# EAGLE design TubeBoard-Logic (EAGLE 9.3.2)

## Sheet 1 of 2
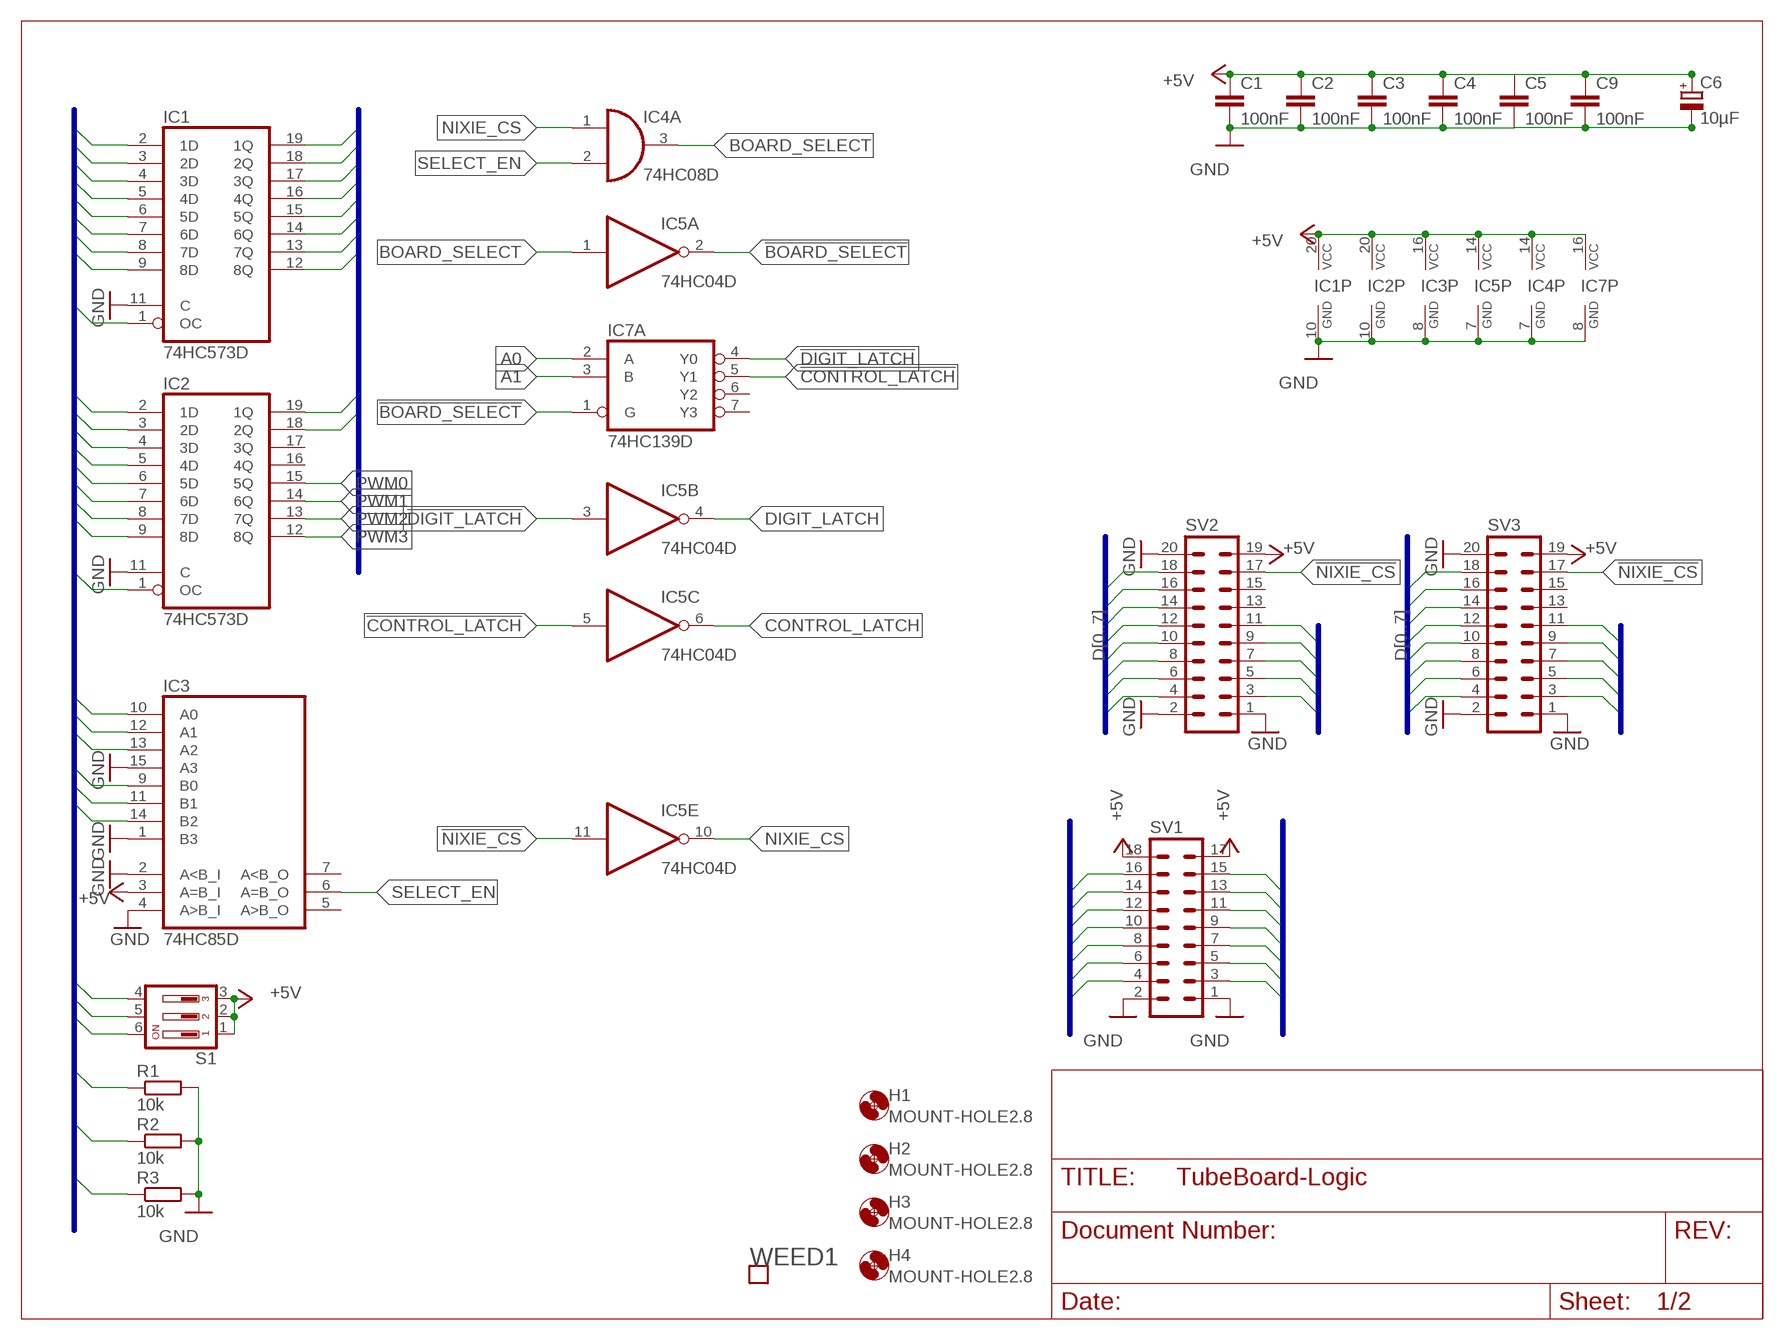
[diagram p0: schematic, sheet 1]

### Parts
C1  100nF  C-EUC1206  [C1206]
C2  100nF  C-EUC1206  [C1206]
C3  100nF  C-EUC1206  [C1206]
C4  100nF  C-EUC1206  [C1206]
C5  100nF  C-EUC1206  [C1206]
C6  10µF  CPOL-EUSMCB  [SMC_B]
C9  100nF  C-EUC1206  [C1206]
H1  MOUNT-HOLE2.8  [2,8]
H2  MOUNT-HOLE2.8  [2,8]
H3  MOUNT-HOLE2.8  [2,8]
H4  MOUNT-HOLE2.8  [2,8]
IC1  74HC573D  [SO20W]
IC2  74HC573D  [SO20W]
IC3  74HC85D  [SO16]
IC4  74HC08D  [SO14]
IC5  74HC04D  [SO14]
IC7  74HC139D  [SO16]
R1  10k  R-EU_R2012  [R2012]
R2  10k  R-EU_R2012  [R2012]
R3  10k  R-EU_R2012  [R2012]
S1  SD4-03  [SD4-03]
SV1  MA09-2  [MA09-2]
SV2  MA10-2  [MA10-2]
SV3  MA10-2  [MA10-2]
WEED1  WEED  [DOINK]

### Nets
!BOARD_SELECT: IC5.2(A:O) IC7.1(A:G)
!CONTROL_LATCH: IC5.5(C:I) IC7.5(A:Y1)
!DIGIT_LATCH: IC5.3(B:I) IC7.4(A:Y0)
!NIXIE_CS: IC5.11(E:I) SV2.17 SV3.17
+5V: C1.1 C2.1 C3.1 C4.1 C5.1 C6.+ C9.1 IC1.20(VCC) IC2.20(VCC) IC3.3(A=B_I) IC3.16(VCC) IC4.14(P:VCC) IC5.14(P:VCC) IC7.16(P:VCC) S1.1 S1.2 S1.3 SV1.17 SV1.18 SV2.19 SV3.19
A0: IC7.2(A:A) SV2.3 SV3.3
A1: IC7.3(A:B) SV2.5 SV3.5
A2: IC3.10(A0) SV2.7 SV3.7
A3: IC3.12(A1) SV2.9 SV3.9
A4: IC3.13(A2) SV2.11 SV3.11
BOARD_SELECT: IC4.3(A:O) IC5.1(A:I)
COLON_B: IC2.19(1Q) SV1.8
COLON_T: IC2.18(2Q) SV1.6
CONTROL_LATCH: IC2.1(OC) IC5.6(C:O)
D0: IC1.2(1D) IC2.2(1D) SV2.8 SV3.8
D1: IC1.3(2D) IC2.3(2D) SV2.6 SV3.6
D2: IC1.4(3D) IC2.4(3D) SV2.4 SV3.4
D3: IC1.5(4D) IC2.5(4D) SV2.10 SV3.10
D4: IC1.6(5D) IC2.6(5D) SV2.12 SV3.12
D5: IC1.7(6D) IC2.7(6D) SV2.14 SV3.14
D6: IC1.8(7D) IC2.8(7D) SV2.16 SV3.16
D7: IC1.9(8D) IC2.9(8D) SV2.18 SV3.18
DIGIT_LATCH: IC1.1(OC) IC5.4(B:O)
GND: C1.2 C2.2 C3.2 C4.2 C5.2 C6.- C9.2 IC1.10(GND) IC1.11(C) IC2.10(GND) IC2.11(C) IC3.1(B3) IC3.2(A<B_I) IC3.4(A>B_I) IC3.8(GND) IC3.15(A3) IC4.7(P:GND) IC5.7(P:GND) IC7.8(P:GND) R1.2 R2.2 R3.2 SV1.1 SV1.2 SV2.1 SV2.2 SV2.20 SV3.1 SV3.2 SV3.20 ; also sheet 2
ID0: IC3.9(B0) R3.1 S1.6
ID1: IC3.11(B1) R2.1 S1.5
ID2: IC3.14(B2) R1.1 S1.4
LDIGIT0: IC1.19(1Q) SV1.16
LDIGIT1: IC1.18(2Q) SV1.14
LDIGIT2: IC1.17(3Q) SV1.12
LDIGIT3: IC1.16(4Q) SV1.10
NIXIE_CS: IC4.1(A:I0) IC5.10(E:O)
PWM0: IC2.15(5Q) SV1.7
PWM1: IC2.14(6Q) SV1.5
PWM2: IC2.13(7Q) SV1.3
PWM3: IC2.12(8Q) SV1.4
RDIGIT0: IC1.15(5Q) SV1.15
RDIGIT1: IC1.14(6Q) SV1.13
RDIGIT2: IC1.13(7Q) SV1.11
RDIGIT3: IC1.12(8Q) SV1.9
SELECT_EN: IC3.6(A=B_O) IC4.2(A:I1)
Unconnected: IC2.16(4Q) IC2.17(3Q) IC3.5(A>B_O) IC3.7(A<B_O) IC7.6(A:Y2) IC7.7(A:Y3) IC7.9(B:Y3) IC7.10(B:Y2) IC7.11(B:Y1) IC7.12(B:Y0) IC7.13(B:B) IC7.14(B:A) IC7.15(B:G) SV2.13 SV2.15 SV3.13 SV3.15

### Buses
D[0..7]
A[0..19]
A[0..4],CONTROL_LATCH,D[0..7],DIGIT_LATCH,ID[0..2]
COLON_B,COLON_T,DRIVE[0..3],LDIGIT[0..3],RDIGIT[0..3]

## Sheet 2 of 2
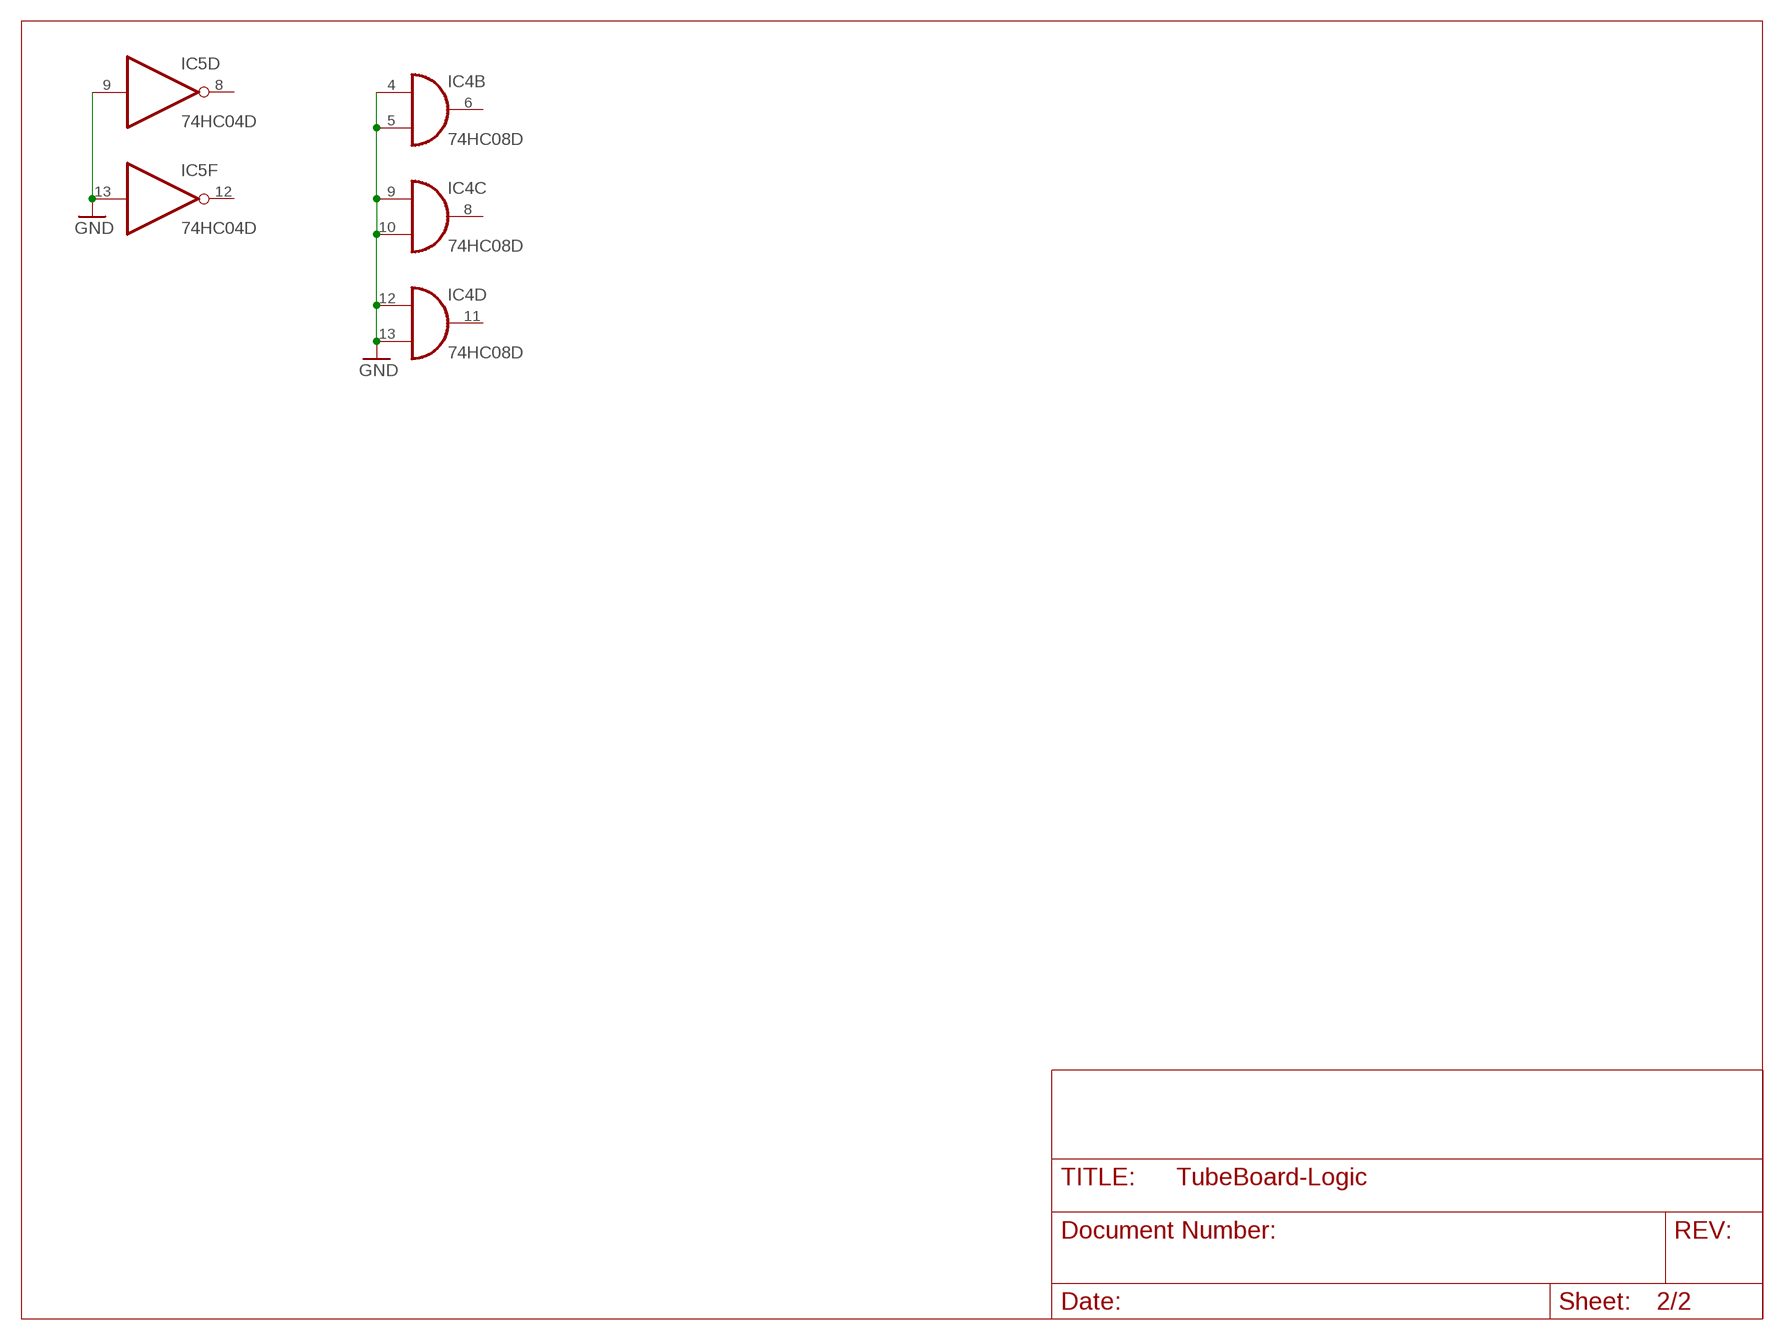
[diagram p1: schematic, sheet 2]

### Nets
GND: IC4.4(B:I0) IC4.5(B:I1) IC4.9(C:I0) IC4.10(C:I1) IC4.12(D:I0) IC4.13(D:I1) IC5.9(D:I) IC5.13(F:I) ; also sheet 1
Unconnected: IC4.6(B:O) IC4.8(C:O) IC4.11(D:O) IC5.8(D:O) IC5.12(F:O)

## Library data of the parts
C1-C5 C9 = rcl:C-EU: CAPACITOR, European symbol; SPICEPREFIX: C
C6 = rcl:CPOL-EU: POLARIZED CAPACITOR, European symbol; MOUSER: 581-TAJB106K020RNJV; SPICEPREFIX: C
H1-H4 = holes:MOUNT-HOLE: MOUNTING HOLE with drill center marker
IC1 IC2 = 74xx-eu:74*573: 8-bit D latch BUS DRIVER
IC3 = 74xx-eu:74*85: 4-bit magnitude COMPARATOR; MOUSER: 771-74HC85D-T
IC4 = 74xx-eu:74*08: Quad 2-input AND gate
IC5 = 74xx-eu:74*04: Hex INVERTER
IC7 = 74xx-eu:74*139: Dual 2-line to 4-line DECODER/DEMULTIPLEXER; MOUSER: 771-HC139D652
R1-R3 = rcl:R-EU_: RESISTOR, European symbol; MOUSER: 652-CR0805FX-1002ELF; SPICEPREFIX: R
S1 = switch-dil:SD4-03: DIL/CODE SWITCH; MOUSER: 611-BDB03; OC_FARNELL: unknown; OC_NEWARK: unknown
SV1 = con-lstb:MA09-2: PIN HEADER; OC_FARNELL: unknown; OC_NEWARK: unknown
SV2 SV3 = con-lstb:MA10-2: PIN HEADER; OC_FARNELL: unknown; OC_NEWARK: unknown
WEED1 = Parts:WEED

## Net classes
0 default: width 0.203 mm

## Board
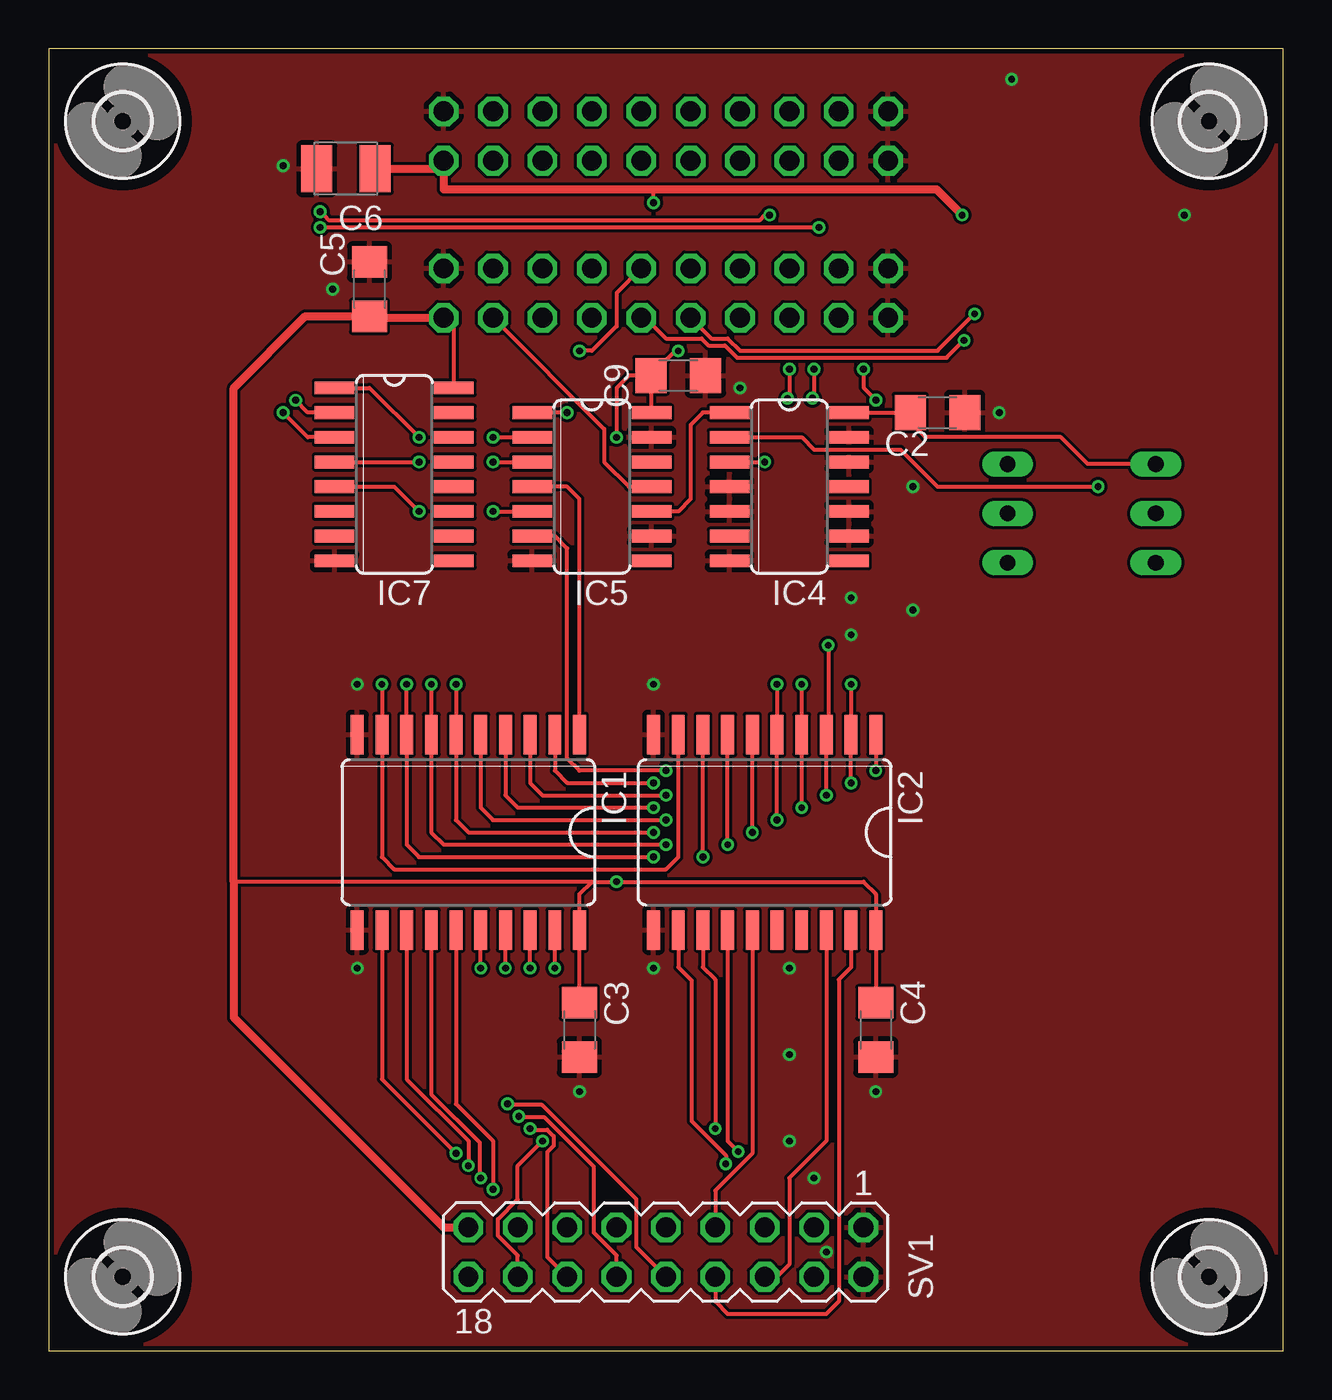
[diagram p2: board, top side]
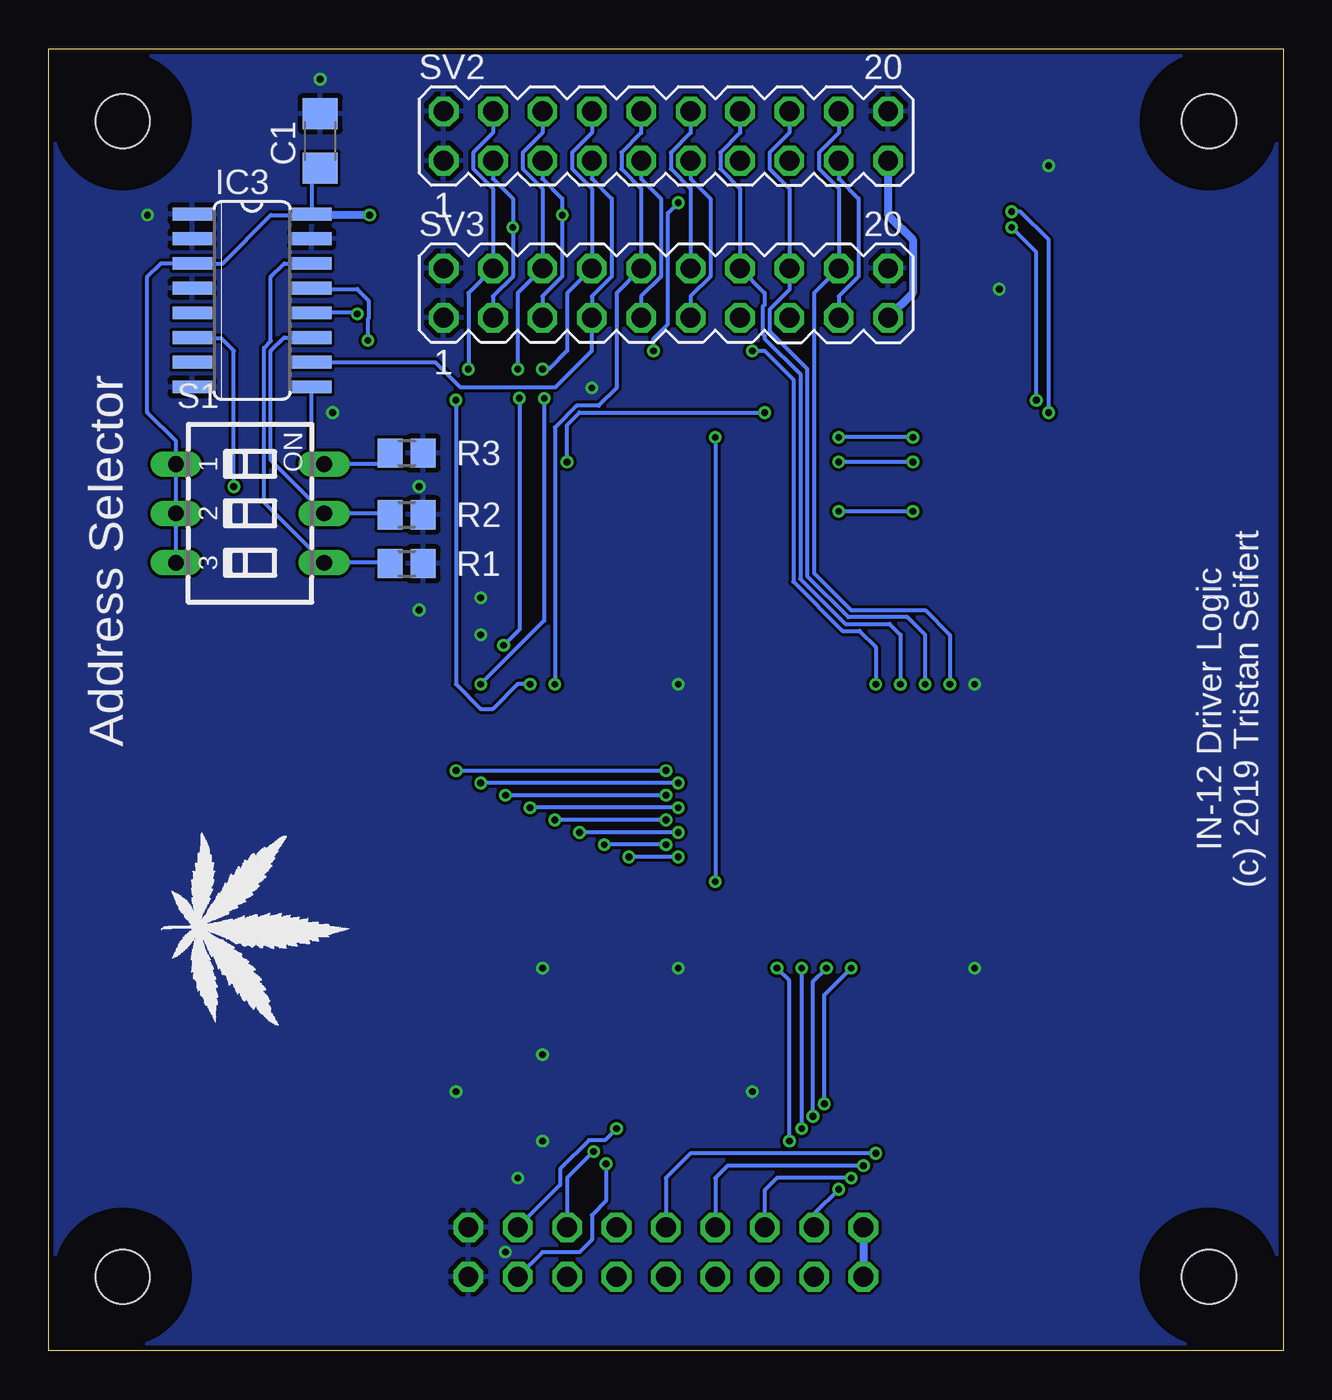
[diagram p3: board, bottom side, seen from below]

Size 63.5 x 66.98 mm. Coordinates in mm from the lower left corner, seen from the top.
Outline: 0,0 63.5,0 63.5,66.98 0,66.98 0,0
Copper layers (1*16): Top 0.035mm / dielectric 1.5mm / Bottom 0.035mm
Design rules "dirt_cheap_dirty_boards.v1.1": minimum track width 6mil, minimum drill 12mil, track to track 6mil, track to pad 6mil, pad to pad 6mil, via to via 6mil, smd to smd 0mil, copper to edge 10mil, drill to drill 10mil, minimum pad ring 10mil, minimum via ring 6mil, stop-mask expansion 2mil, vias tented up to drill 25mil, thermal gap 10mil

### Footprints (pad centres in the part's own frame; a part is rotated, then mirrored left to right if it is on the bottom)
C1206 = smd 1.6 x 1.8: 1 -1.4,0; 2 1.4,0
SMC_B = smd 1.6 x 2.4: + -1.5,0; - 1.5,0
2,8 = hole 2.8: 0,0
SO20W = smd 0.66 x 2.032: 1 -5.715,-5.029; 2 -4.445,-5.029; 3 -3.175,-5.029; 4 -1.905,-5.029; 5 -0.635,-5.029; 6 0.635,-5.029; 7 1.905,-5.029; 8 3.175,-5.029; 9 4.445,-5.029; 10 5.715,-5.029; 11 5.715,5.029; 12 4.445,5.029; 13 3.175,5.029; 14 1.905,5.029; 15 0.635,5.029; 16 -0.635,5.029; 17 -1.905,5.029; 18 -3.175,5.029; 19 -4.445,5.029; 20 -5.715,5.029
SO16 = smd 0.66 x 2.032: 1 -4.445,-3.073; 2 -3.175,-3.073; 3 -1.905,-3.073; 4 -0.635,-3.073; 5 0.635,-3.073; 6 1.905,-3.073; 7 3.175,-3.073; 8 4.445,-3.073; 9 4.445,3.073; 10 3.175,3.073; 11 1.905,3.073; 12 0.635,3.073; 13 -0.635,3.073; 14 -1.905,3.073; 15 -3.175,3.073; 16 -4.445,3.073
SO14 = smd 0.66 x 2.032: 1 -3.81,-3.073; 2 -2.54,-3.073; 3 -1.27,-3.073; 4 0,-3.073; 5 1.27,-3.073; 6 2.54,-3.073; 7 3.81,-3.073; 8 3.81,3.073; 9 2.54,3.073; 10 1.27,3.073; 11 0,3.073; 12 -1.27,3.073; 13 -2.54,3.073; 14 -3.81,3.073
R2012 = smd 1.3 x 1.5: 1 -0.85,0; 2 0.85,0
SD4-03 = drill 0.813 long: 1 -2.54,-3.81; 2 0,-3.81; 3 2.54,-3.81; 4 2.54,3.81; 5 0,3.81; 6 -2.54,3.81
MA09-2 = drill 1.016 octagon: 1 -10.16,-1.27; 2 -10.16,1.27; 3 -7.62,-1.27; 4 -7.62,1.27; 5 -5.08,-1.27; 6 -5.08,1.27; 7 -2.54,-1.27; 8 -2.54,1.27; 9 0,-1.27; 10 0,1.27; 11 2.54,-1.27; 12 2.54,1.27; 13 5.08,-1.27; 14 5.08,1.27; 15 7.62,-1.27; 16 7.62,1.27; 17 10.16,-1.27; 18 10.16,1.27
MA10-2 = drill 1.016 octagon: 1 -11.43,-1.27; 2 -11.43,1.27; 3 -8.89,-1.27; 4 -8.89,1.27; 5 -6.35,-1.27; 6 -6.35,1.27; 7 -3.81,-1.27; 8 -3.81,1.27; 9 -1.27,-1.27; 10 -1.27,1.27; 11 1.27,-1.27; 12 1.27,1.27; 13 3.81,-1.27; 14 3.81,1.27; 15 6.35,-1.27; 16 6.35,1.27; 17 8.89,-1.27; 18 8.89,1.27; 19 11.43,-1.27; 20 11.43,1.27

### Placement (x,y rotation side)
C1  49.53,62.23 90 bottom
C2  45.72,48.26 0 top
C3  27.3,16.51 270 top
C4  42.55,16.51 270 top
C5  16.51,54.61 90 top
C6  15.29,60.81 180 top
C9  32.38,50.16 0 top
H1  3.81,3.81 0 top
H2  59.69,3.81 0 top
H3  3.81,63.25 0 top
H4  59.69,63.25 0 top
IC1  21.59,26.67 180 top
IC2  36.83,26.67 180 top
IC3  53.04,54.03 270 bottom
IC4  38.1,44.45 270 top
IC5  27.94,44.45 270 top
IC7  17.78,45.09 270 top
R1  45.09,40.49 0 bottom
R2  45.09,43 0 bottom
R3  45.09,46.18 0 bottom
S1  53.14,43.08 270 bottom
SV1  31.75,5.08 180 top
SV2  31.75,62.48 0 bottom
SV3  31.75,54.41 0 bottom
WEED1  57.78,26.67 270 bottom

### Tracks (layer width: path | path; a pad name or v marks a point on that pad's centre or on a via)
!BOARD_SELECT  (via drill 0.35)
  Top 0.203: IC7.1 16.51,49.53 v19.05,46.99 | v22.86,46.99 IC5.2
  Bottom 0.203: v19.05,46.99 v22.86,46.99
!CONTROL_LATCH  (via drill 0.35)
  Top 0.203: v19.05,43.18 17.78,44.45 IC7.5 | v22.86,43.18 IC5.5
  Bottom 0.203: v19.05,43.18 v22.86,43.18
!DIGIT_LATCH  (via drill 0.35)
  Top 0.203: IC7.4 v19.05,45.72 | v22.86,45.72 IC5.3
  Bottom 0.203: v19.05,45.72 v22.86,45.72
!NIXIE_CS
  Top 0.203: SV3.17 28.57,47.42 28.57,45.72 29.84,44.45 IC5.11
  Bottom 0.203: SV2.17 22.86,60.28 21.84,59.26 21.84,55.26 22.86,54.24 SV3.17
+5V  (via drill 0.35)
  Top 0.203: IC4.14 C2.1 44.32,47.76 45.09,46.99 52.07,46.99 53.44,45.62 S1.1 | IC7.16 20.85,52.6 SV3.19 | C9.1 30.98,48.29 IC5.14 | C3.1 IC1.20 27.3,23.5 27.94,24.13 | C4.1 IC2.20 42.55,23.5 41.91,24.13 v29.21,24.13 27.94,24.13 | 27.94,24.13 9.53,24.13 | C9.1 29.84,50.16 29.21,49.53 v29.21,46.99 | C9.1 32.26,51.44 v32.38,51.44 | v31.11,59.05 31.11,59.74
  Top 0.406: SV3.19 16.64,53.14 16.57,53.21 C5.1 13.21,53.21 9.53,49.53 9.53,24.13 9.53,17.14 20.32,6.35 SV1.17 | C6.+ 19.91,60.81 SV2.19 20.32,59.74 31.11,59.74 45.67,59.74 v46.99,58.42
  Bottom 0.203: S1.3 S1.2 S1.1 56.95,46.79 58.42,48.26 58.42,55.24 57.73,55.93 IC3.3 54.56,55.93 52.07,58.42 50.01,58.42 IC3.16 49.96,60.4 C1.1 | v29.21,46.99 v29.21,24.13 | v32.38,51.44 32.38,52.07 31.65,52.81 31.65,58.52 v31.11,59.05
  Bottom 0.406: SV2.19 20.32,58.42 19.05,57.15 19.05,54.41 SV3.19 | SV1.17 SV1.18 | v46.99,58.42 49.91,58.42 IC3.16
A0  (via drill 0.35)
  Top 0.203: IC7.2 13.34,48.26 v12.7,48.9 | v13.97,57.78 v39.62,57.78
  Bottom 0.203: SV2.3 40.64,60.28 39.62,59.26 v39.62,57.78 39.62,55.26 40.64,54.24 SV3.3 | v12.7,48.9 12.7,56.52 v13.97,57.78
A1  (via drill 0.35)
  Top 0.203: IC7.3 13.34,46.99 v12.06,48.26 | v37.08,58.42 36.83,58.42 36.55,58.14 14.44,58.14 14.21,58.37 14.2,58.37 v13.97,58.59
  Bottom 0.203: SV2.5 38.1,60.28 37.08,59.26 v37.08,58.42 37.08,55.26 38.1,54.24 SV3.5 | v12.06,48.26 12.06,57.15 13.51,58.59 v13.97,58.59
A2
  Bottom 0.203: SV2.7 35.56,60.28 34.54,59.26 34.54,55.26 35.56,54.24 SV3.7 35.56,51.44 37.41,49.58 42.34,49.58 43.61,50.85 IC3.10
A3  (via drill 0.35)
  Top 0.203: SV3.9 34.09,52.07 34.92,52.07 35.56,51.44 45.72,51.44 v47.62,53.34
  Bottom 0.203: SV2.9 33.02,60.28 32,59.26 32,55.26 33.02,54.24 SV3.9 | v47.62,53.34 47.68,53.39 IC3.12
A4  (via drill 0.35)
  Top 0.203: SV3.11 30.68,53.14 31.75,52.07 33.58,52.07 33.94,51.71 34.78,51.71 35.41,51.08 46.19,51.08 v47.08,51.98
  Bottom 0.203: SV2.11 30.48,60.28 29.46,59.26 29.46,55.26 30.48,54.24 SV3.11 | IC3.13 49.91,54.61 47.62,54.61 47.04,54.03 47.04,53.1 47.08,53.06 v47.08,51.98
BOARD_SELECT  (via drill 0.35)
  Top 0.203: IC4.3 v36.83,45.72 | v26.67,48.26 IC5.1
  Bottom 0.203: v36.83,45.72 36.83,47.62 36.2,48.26 v26.67,48.26
COLON_B
  Top 0.203: IC2.19 41.27,19.74 40.64,19.1 40.64,2.54 40.01,1.91 34.92,1.91 34.29,2.54 SV1.8
COLON_T
  Top 0.203: IC2.18 40.01,10.79 38.1,8.89 38.1,4.45 37.47,3.81 SV1.6
CONTROL_LATCH  (via drill 0.35)
  Top 0.203: IC2.1 v42.55,29.84 | v31.75,29.84 27.3,29.84 26.67,30.48 26.67,41.27 26.04,41.91 IC5.6
  Bottom 0.203: v42.55,29.84 v31.75,29.84
D0  (via drill 0.35)
  Top 0.203: IC1.2 26.04,29.84 26.67,29.21 v31.11,29.21 | v41.27,29.21 IC2.2 v41.27,34.29 | v38.1,50.5 38.1,49.08 v38.01,48.99
  Bottom 0.203: SV2.8 35.56,62.65 36.58,61.63 36.58,60.79 35.56,59.78 SV3.8 36.83,54.41 36.83,51.44 37.77,50.5 v38.1,50.5 | v31.11,29.21 v41.27,29.21 | v38.01,48.99 38.01,37.56 v41.27,34.29
D1  (via drill 0.35)
  Top 0.203: IC1.3 24.77,29.21 25.4,28.57 v31.75,28.57 | v40.01,28.57 IC2.3 40.1,31.79 v40.1,36.29 | v39.37,50.5 39.37,49.08 v39.29,49
  Bottom 0.203: SV2.6 38.1,62.65 39.12,61.63 39.12,60.79 38.1,59.78 SV3.6 39.37,54.41 v39.37,50.5 | v31.75,28.57 v40.01,28.57 | v39.29,49 39.29,37.1 v40.1,36.29
D2  (via drill 0.35)
  Top 0.203: IC1.4 23.5,28.57 24.13,27.94 v31.11,27.94 | v38.73,27.94 IC2.4 v38.73,34.29 | v41.91,50.5 41.91,49.55 v42.55,48.9
  Bottom 0.203: SV2.4 40.64,62.65 41.66,61.63 41.66,60.79 40.64,59.78 SV3.4 41.91,54.41 v41.91,50.5 | v31.11,27.94 v38.73,27.94 | v38.73,34.29 39.37,34.29 40.64,33.02 41.27,33.02 42.55,34.3 v42.55,48.9
D3  (via drill 0.35)
  Top 0.203: IC1.5 22.23,27.94 22.86,27.3 v31.75,27.3 | v37.47,27.3 IC2.5 v37.47,34.29
  Bottom 0.203: SV2.10 33.02,62.65 34.04,61.63 34.04,60.79 33.02,59.78 SV3.10 34.29,54.41 34.29,49.53 35.2,48.62 36.34,48.62 37.47,47.49 v37.47,34.29 | v31.75,27.3 v37.47,27.3
D4  (via drill 0.35)
  Top 0.203: v31.11,26.67 21.59,26.67 20.95,27.3 IC1.6 v20.95,34.29 | v36.2,26.67 IC2.6 | SV3.12 29.21,54.41 29.21,52.7 27.94,51.44 v27.3,51.44
  Bottom 0.203: SV2.12 30.48,62.65 31.5,61.63 31.5,60.79 30.48,59.78 SV3.12 | v31.11,26.67 v36.2,26.67 | v27.3,51.44 26.67,51.44 25.2,49.96 25.2,39.56 22.67,37.03 21.79,37.03 20.95,36.2 v20.95,34.29
D5  (via drill 0.35)
  Top 0.203: v31.75,26.04 20.32,26.04 19.68,26.67 IC1.7 v19.68,34.29 | v34.92,26.04 IC2.7
  Bottom 0.203: SV2.14 27.94,62.65 28.96,61.63 28.96,60.79 27.94,59.78 SV3.14 26.67,54.41 26.67,53.81 26.77,53.7 26.77,52.3 26.67,52.2 26.67,52.07 24.84,50.24 24.84,39.71 22.52,37.39 20.24,37.39 19.68,36.83 v19.68,34.29 | v31.75,26.04 v34.92,26.04
D6  (via drill 0.35)
  Top 0.203: v31.11,25.4 19.05,25.4 18.41,26.04 IC1.8 v18.41,34.29 | v33.66,25.4 IC2.8
  Bottom 0.203: SV2.16 25.4,62.65 26.42,61.63 26.42,60.79 25.4,59.78 SV3.16 25.4,54.57 26.42,53.56 26.42,52.45 24.49,50.52 24.49,39.86 22.37,37.74 19.33,37.74 18.41,36.83 v18.41,34.29 | v31.11,25.4 v33.66,25.4
D7  (via drill 0.35)
  Top 0.203: IC2.9 32.38,25.4 31.75,24.77 17.78,24.77 17.14,25.4 IC1.9 v17.14,34.29
  Bottom 0.203: SV2.18 22.86,62.65 23.88,61.63 23.88,60.79 22.86,59.78 SV3.18 24.13,54.41 24.13,40.01 22.23,38.1 18.41,38.1 17.14,36.83 v17.14,34.29
DIGIT_LATCH
  Top 0.203: IC1.1 27.3,43.81 26.67,44.45 IC5.4
GND  (via drill 0.35)
  other vias: 41.27,38.73 41.27,36.83 44.45,38.1 44.45,44.45 48.9,48.26 35.56,49.53 42.55,13.34 27.3,13.34 15.88,19.68 31.11,19.68 31.11,34.29 15.88,34.29 49.53,65.41 58.42,58.42 12.06,60.96 14.61,54.61 38.1,19.68 38.1,10.79 39.37,8.89 40.01,5.08 38.1,15.24
  pour Top: 0,0 0,67.06 63.5,67.06 63.5,0
  pour Bottom: 0,0 0,67.06 63.5,67.06 63.5,0
ID0
  Bottom 0.203: R3.1 46.49,45.62 S1.6 49.96,46.25 IC3.9
ID1
  Bottom 0.203: R2.1 46.01,43.08 S1.5 52.07,45.82 52.07,51.44 51.38,52.12 IC3.11
ID2
  Bottom 0.203: R1.1 45.99,40.54 S1.4 52.43,43.64 52.43,51.58 52.07,51.94 52.07,55.24 51.38,55.93 IC3.14
LDIGIT0  (via drill 0.35)
  Top 0.203: v26.04,19.68 IC1.19 | v25.4,10.79 24.13,9.53 24.13,7.79 23.11,6.77 23.11,5.93 24.13,4.91 SV1.16
  Bottom 0.203: v25.4,10.79 25.4,19.05 v26.04,19.68
LDIGIT1  (via drill 0.35)
  Top 0.203: v24.77,11.43 24.82,11.38 25.64,11.38 25.98,11.04 25.98,10.55 25.64,10.21 25.64,4.84 SV1.14 | v24.77,19.68 IC1.18
  Bottom 0.203: v24.77,11.43 v24.77,19.68
LDIGIT2  (via drill 0.35)
  Top 0.203: SV1.12 29.21,4.91 28.04,6.08 28.04,9.48 25.51,12.01 24.24,12.01 v24.18,12.06 | v23.5,19.68 IC1.17
  Bottom 0.203: v24.18,12.06 24.18,19 v23.5,19.68
LDIGIT3  (via drill 0.35)
  Top 0.203: SV1.10 30.23,5.33 30.23,7.8 25.38,12.65 23.66,12.65 v23.6,12.7 | v22.23,19.68 IC1.16
  Bottom 0.203: v23.6,12.7 23.6,18.31 v22.23,19.68
NIXIE_CS
  Top 0.203: IC4.1 33.66,48.26 33.02,47.62 33.02,43.81 32.38,43.18 IC5.10
PWM0
  Top 0.203: IC2.15 36.2,10.16 34.29,8.26 SV1.7
PWM1  (via drill 0.35)
  Top 0.203: IC2.14 34.92,10.79 v35.47,10.25
  Bottom 0.203: v35.47,10.25 36.83,8.89 SV1.5
PWM2  (via drill 0.35)
  Top 0.203: IC2.13 33.66,19.74 34.29,19.1 v34.29,11.43
  Bottom 0.203: SV1.3 37.19,8.53 37.19,9.36 35.71,10.84 34.88,10.84 v34.29,11.43
PWM3  (via drill 0.35)
  Top 0.203: IC2.12 32.38,19.74 33.07,19.05 33.07,11.83 34.83,10.07 v34.83,9.62
  Bottom 0.203: v34.83,9.62 34.83,7.71 35.56,6.99 35.56,5.71 36.2,5.08 38.1,5.08 SV1.4
RDIGIT0  (via drill 0.35)
  Top 0.203: IC1.15 20.95,12.7 22.86,10.79 v22.86,8.31
  Bottom 0.203: v22.86,8.31 24.13,7.04 SV1.15
RDIGIT1  (via drill 0.35)
  Top 0.203: IC1.14 19.68,13.2 22.17,10.72 22.17,8.94 v22.23,8.89
  Bottom 0.203: v22.23,8.89 26.04,8.89 26.67,8.26 SV1.13
RDIGIT2  (via drill 0.35)
  Top 0.203: IC1.13 18.41,13.97 21.59,10.79 v21.59,9.53
  Bottom 0.203: v21.59,9.53 28.57,9.53 29.21,8.89 SV1.11
RDIGIT3  (via drill 0.35)
  Top 0.203: IC1.12 17.14,13.97 v20.95,10.16
  Bottom 0.203: SV1.9 31.75,8.89 30.48,10.16 v20.95,10.16
SELECT_EN  (via drill 0.35)
  Top 0.203: v53.98,44.45 45.72,44.45 43.81,46.35 39.37,46.35 38.73,46.99 IC4.2
  Bottom 0.203: IC3.6 56.11,52.07 54.61,52.07 53.98,51.44 v53.98,44.45

### Text on the board
bNames: Address Selector | IN-12 Driver Logic / (c) 2019 Tristan Seifert